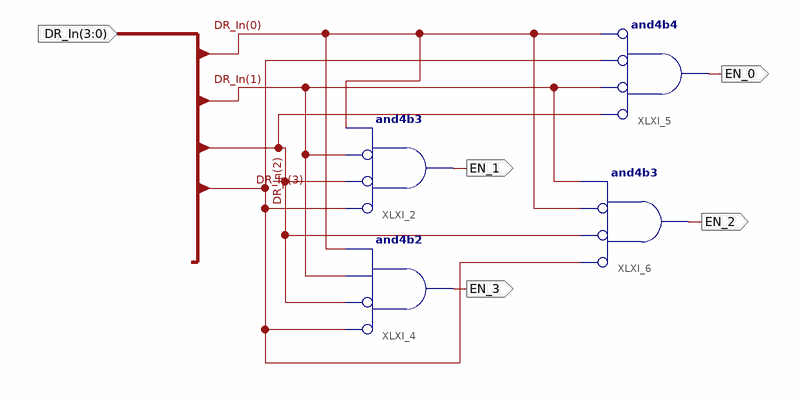
[diagram p0: schematic sheet 1]
// Xilinx ISE schematic MUX_DR.sch (spartan3e) as structural Verilog: 4 symbols, 5 ports
module MUX_DR (
  input  [3:0] DR_In,
  output EN_1,
  output EN_3,
  output EN_0,
  output EN_2
);

  and XLXI_2 (EN_1, ~DR_In[3], ~DR_In[2], ~DR_In[1], DR_In[0]);  // and4b3
  and XLXI_4 (EN_3, ~DR_In[3], ~DR_In[2], DR_In[1], DR_In[0]);  // and4b2
  and XLXI_5 (EN_0, ~DR_In[2], ~DR_In[1], ~DR_In[3], ~DR_In[0]);  // and4b4
  and XLXI_6 (EN_2, ~DR_In[3], ~DR_In[2], ~DR_In[0], DR_In[1]);  // and4b3
endmodule
